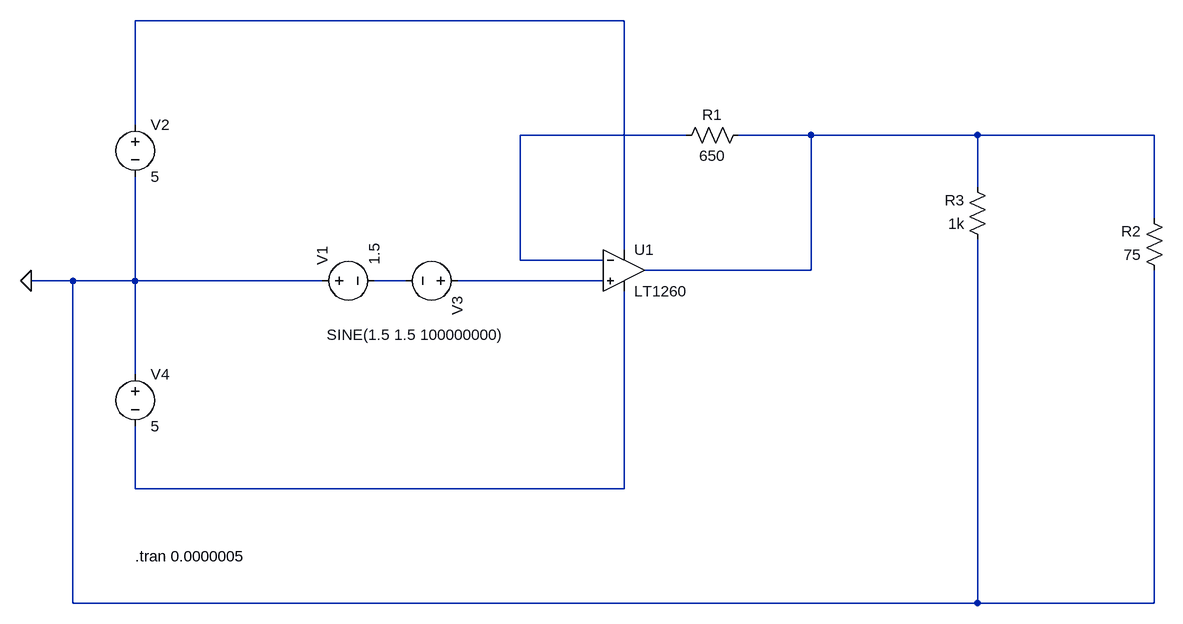
[diagram p0: schematic aa.asc]
aa.asc, the LTspice schematic file:
Version 4
SHEET 1 1108 680
WIRE 272 -384 -480 -384
WIRE -480 -224 -480 -384
WIRE 368 -208 112 -208
WIRE 560 -208 448 -208
WIRE 816 -208 560 -208
WIRE 1088 -208 816 -208
WIRE 816 -128 816 -208
WIRE 1088 -80 1088 -208
WIRE 272 -32 272 -384
WIRE 112 -16 112 -208
WIRE 240 -16 112 -16
WIRE 560 0 560 -208
WIRE 560 0 304 0
WIRE -576 16 -640 16
WIRE -480 16 -480 -144
WIRE -480 16 -576 16
WIRE -192 16 -480 16
WIRE -64 16 -112 16
WIRE 240 16 16 16
WIRE -480 160 -480 16
WIRE -480 336 -480 240
WIRE 272 336 272 32
WIRE 272 336 -480 336
WIRE -576 512 -576 16
WIRE 816 512 816 -48
WIRE 816 512 -576 512
WIRE 1088 512 1088 0
WIRE 1088 512 816 512
FLAG -640 16 0
SYMBOL voltage -480 -240 R0
WINDOW 123 0 0 Left 0
WINDOW 39 0 0 Left 0
SYMATTR InstName V2
SYMATTR Value 5
SYMBOL voltage 32 16 R90
WINDOW 3 83 -57 VRight 2
WINDOW 123 0 0 Left 0
WINDOW 39 0 0 Left 0
SYMATTR Value SINE(1.5 1.5 100000000)
SYMATTR InstName V3
SYMBOL res 464 -224 R90
WINDOW 0 0 56 VBottom 2
WINDOW 3 32 56 VTop 2
SYMATTR InstName R1
SYMATTR Value 650
SYMBOL voltage -480 144 R0
WINDOW 123 0 0 Left 0
WINDOW 39 0 0 Left 0
SYMATTR InstName V4
SYMATTR Value 5
SYMBOL voltage -208 16 R270
WINDOW 123 0 0 Left 0
WINDOW 39 0 0 Left 0
SYMATTR InstName V1
SYMATTR Value 1.5
SYMBOL res 832 -32 R180
WINDOW 0 36 76 Left 2
WINDOW 3 36 40 Left 2
SYMATTR InstName R3
SYMATTR Value 1k
SYMBOL Opamps\\LT1260 272 -64 R0
SYMATTR InstName U1
SYMBOL res 1104 16 R180
WINDOW 0 36 76 Left 2
WINDOW 3 36 40 Left 2
SYMATTR InstName R2
SYMATTR Value 75
TEXT -480 440 Left 2 !.tran 0.0000005

The netlist it stands for:
* aa.asc
V2 N001 0 5
V3 N005 N004 SINE(1.5 1.5 100000000)
R1 N003 N002 650
V4 0 N006 5
V1 0 N004 1.5
R3 0 N003 1k
XU1 N005 N002 N001 N006 N003 LT1260  ; pins In+ In- V+ V- OUT
R2 0 N003 75
.tran 0.0000005
.backanno
.end